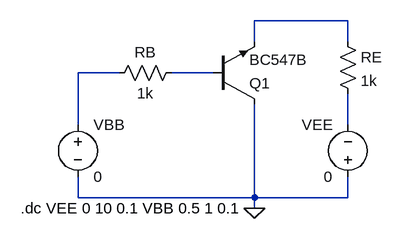
[diagram p0: schematic Common Collector.asc]
Common Collector.asc, the LTspice schematic file:
Version 4
SHEET 1 880 680
WIRE 528 160 384 160
WIRE 384 192 384 160
WIRE 528 192 528 160
WIRE 176 240 112 240
WIRE 320 240 256 240
WIRE 112 320 112 240
WIRE 528 320 528 272
WIRE 112 432 112 400
WIRE 384 432 384 288
WIRE 384 432 112 432
WIRE 528 432 528 400
WIRE 528 432 384 432
WIRE 384 448 384 432
FLAG 384 448 0
SYMBOL voltage 112 304 R0
SYMATTR InstName VBB
SYMATTR Value 0
SYMBOL voltage 528 416 R180
WINDOW 0 24 96 Left 2
WINDOW 3 24 16 Left 2
SYMATTR InstName VEE
SYMATTR Value 0
SYMBOL res 272 224 R90
WINDOW 0 0 56 VBottom 2
WINDOW 3 32 56 VTop 2
SYMATTR InstName RB
SYMATTR Value 1k
SYMBOL res 512 176 R0
SYMATTR InstName RE
SYMATTR Value 1k
SYMBOL npn 320 288 M180
SYMATTR InstName Q1
SYMATTR Value BC547B
TEXT 24 448 Left 2 !.dc VEE 0 10 0.1 VBB 0.5 1 0.1

The netlist it stands for:
* Common Collector.asc
VBB N002 0 0
VEE 0 N004 0
RB N003 N002 1k
RE N001 N004 1k
Q1 0 N003 N001 0 BC547B
.model NPN NPN
.model PNP PNP
.lib standard.bjt
.dc VEE 0 10 0.1 VBB 0.5 1 0.1
.backanno
.end